# EAGLE design myRadioAddon (EAGLE 7.6.0)
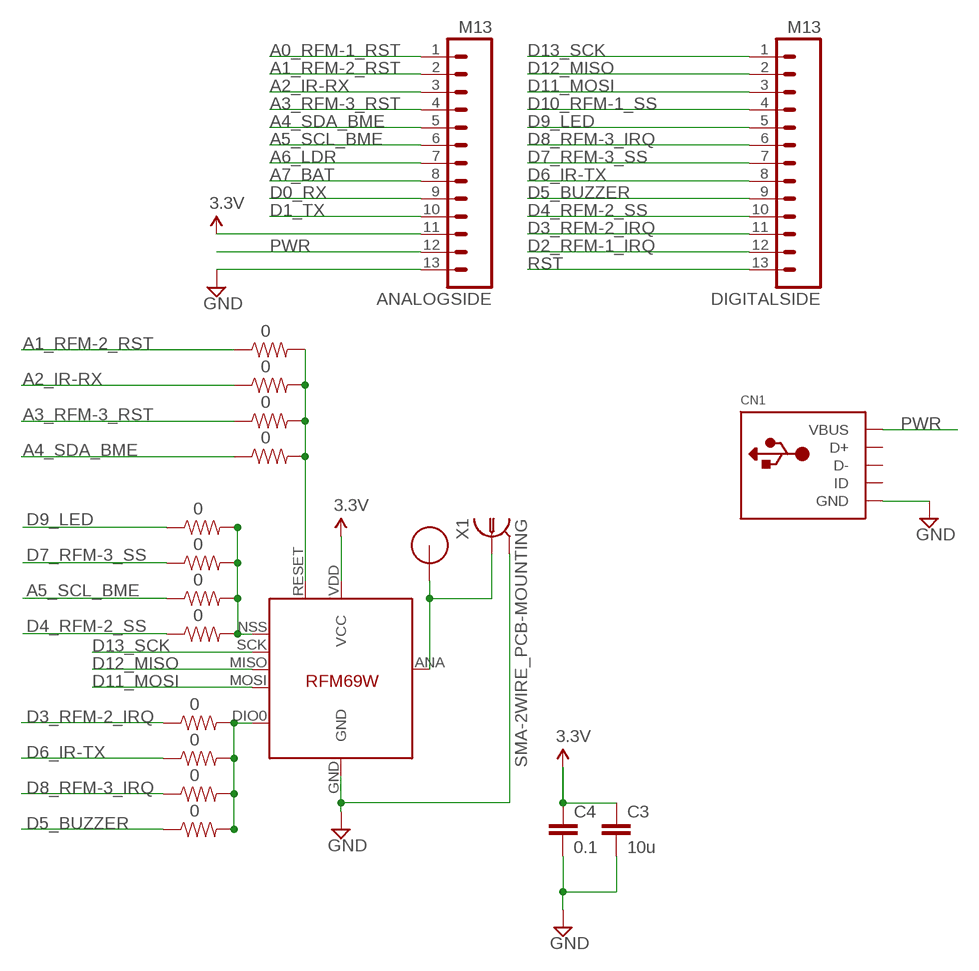
[diagram p0: schematic, sheet 1]

## Parts
ANALOGSIDE  M13  [1X13]
C3  10u  CAP0805-CAP  [0805-CAP]
C4  0.1  CAP0603-CAP  [0603-CAP]
CN1  USBMINIB  [USB-MINIB]
DIGITALSIDE  M13  [1X13]
R1  0  RESISTOR0603-RES  [0603-RES]
R2  0  RESISTOR0603-RES  [0603-RES]
R3  0  RESISTOR0603-RES  [0603-RES]
R4  0  RESISTOR0603-RES  [0603-RES]
R5  0  RESISTOR0603-RES  [0603-RES]
R6  0  RESISTOR0603-RES  [0603-RES]
R7  0  RESISTOR0603-RES  [0603-RES]
R8  0  RESISTOR0603-RES  [0603-RES]
R9  0  RESISTOR0603-RES  [0603-RES]
R10  0  RESISTOR0603-RES  [0603-RES]
R11  0  RESISTOR0603-RES  [0603-RES]
R12  0  RESISTOR0603-RES  [0603-RES]
U$1  RFM12B_ANTENNA  [RFM12B-ANTENNA]
U$5  RFM69_MINIPADS  [RFM69W-MINPADS]
X1  SMA-2WIRE_PCB-MOUNTING  [J01151A0931]

## Nets
A0_RFM-1_RST: ANALOGSIDE.1
A1_RFM-2_RST: ANALOGSIDE.2 R3.1
A2_IR-RX: ANALOGSIDE.3 R7.1
A3_RFM-3_RST: ANALOGSIDE.4 R4.1
A4_SDA_BME: ANALOGSIDE.5 R10.1
A5_SCL_BME: ANALOGSIDE.6 R11.1
A6_LDR: ANALOGSIDE.7
A7_BAT: ANALOGSIDE.8
D0_RX: ANALOGSIDE.9
D1_TX: ANALOGSIDE.10
D2_RFM-1_IRQ: DIGITALSIDE.12
D3_RFM-2_IRQ: DIGITALSIDE.11 R1.1
D4_RFM-2_SS: DIGITALSIDE.10 R2.1
D5_BUZZER: DIGITALSIDE.9 R9.1
D6_IR-TX: DIGITALSIDE.8 R12.1
D7_RFM-3_SS: DIGITALSIDE.7 R6.1
D8_RFM-3_IRQ: DIGITALSIDE.6 R5.1
D9_LED: DIGITALSIDE.5 R8.1
D10_RFM-1_SS: DIGITALSIDE.4
D11_MOSI: DIGITALSIDE.3 U$5.MOSI
D12_MISO: DIGITALSIDE.2 U$5.MISO
D13_SCK: DIGITALSIDE.1 U$5.SCK
GND [power]: ANALOGSIDE.13 C3.2 C4.2 CN1.GND U$5.GND X1.G@1 X1.G@2 X1.G@3 X1.G@4
N$1: R1.2 R5.2 R9.2 R12.2 U$5.DIO0(DIO0/IRQ)
N$2: R2.2 R6.2 R8.2 R11.2 U$5.NSS(SEL)
N$3: U$1.P$1 U$5.ANA(ANT) X1.1
N$4: R3.2 R4.2 R7.2 R10.2 U$5.RESET
PWR [power]: ANALOGSIDE.12 CN1.VBUS
RST: DIGITALSIDE.13
VCC [power]: ANALOGSIDE.11 C3.1 C4.1 U$5.VDD(VCC) ; supply symbol labelled 3.3V
Unconnected: CN1.D+ CN1.D- CN1.ID

## Library data of the parts
ANALOGSIDE DIGITALSIDE = SparkFun-Connectors:M13: 13-pin single row .1" header; BUERKLIN: 59 F 2140
C3 = LowPowerLab:CAP: Capacitor Standard 0603 ceramic capacitor, and 0.1" leaded capacitor.; BUERKLIN: 53 D 2432
C4 = LowPowerLab:CAP: Capacitor Standard 0603 ceramic capacitor, and 0.1" leaded capacitor.; BUERKLIN: 53 D 1726
CN1 = myLib:USB: USB Connectors USBMINIB - Surface Mount Female Mini-B USB Connector 4UConnector: 06564 By microbuilder.eu Thru-hole RA Female Mini-B USB Connector 4UConnector: 18732 By ladyada.net
R1-R12 = LowPowerLab:RESISTOR: Resistor Basic schematic elements and footprints for 0603, 1206, and PTH resistors.; BUERKLIN: 26 E 816
U$1 = LowPowerLab:RFM12B_ANTENNA
U$5 = myLib:RFM69_MINIPADS
X1 = myLib:SMA-2WIRE_PCB-MOUNTING: SMA 50 Ohm Straight Jack Receptacle - PCB Mountung www.telegaertner.de Source: Buerklin Artikelnummer: J01151A0931; BUERKLIN: 76F410

## Net classes
0 default: width 0.381 mm, clearance 0.254 mm
1 power: width 0.508 mm, clearance 0.254 mm

## Board
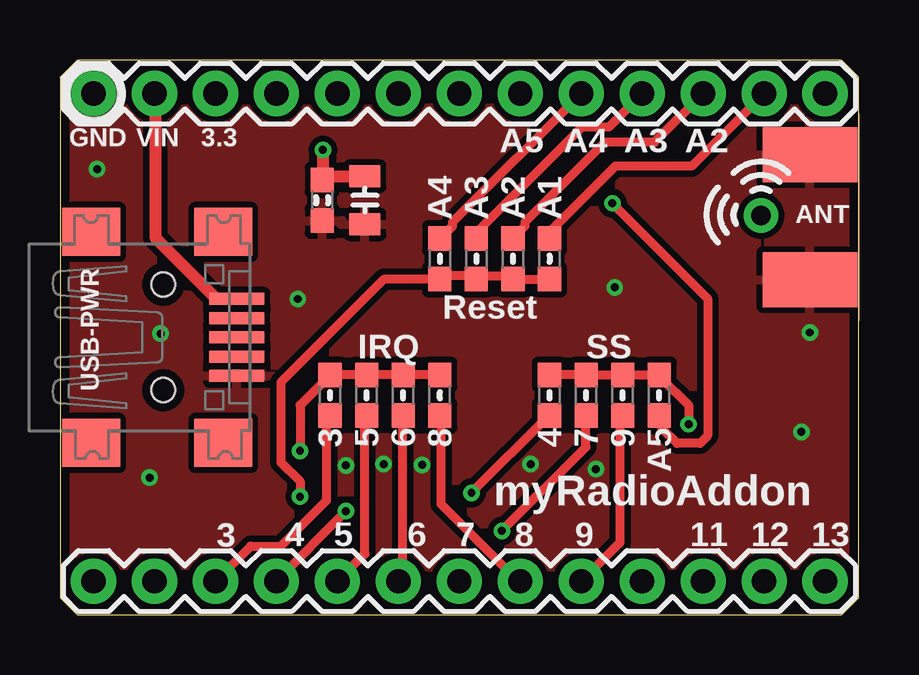
[diagram p1: board, top side]
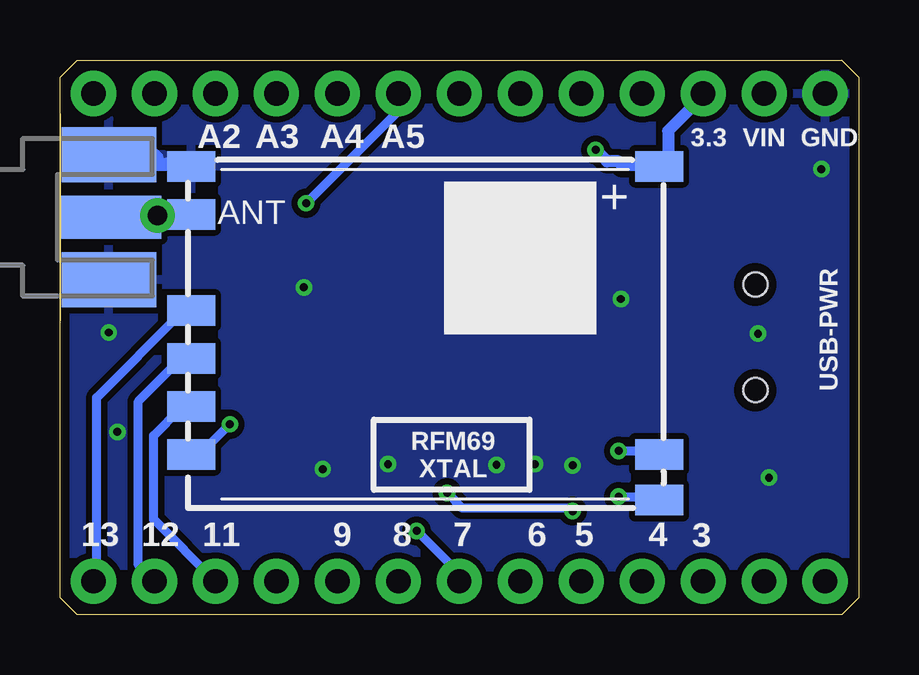
[diagram p2: board, bottom side, seen from below]

Size 33.27 x 23.11 mm. Coordinates in mm from the lower left corner, seen from the top.
Outline: 0.71,0 32.56,0 33.27,0.71 33.27,22.4 32.56,23.11 0.71,23.11 0,22.4 0,0.71 0.71,0
Copper layers (1*16): Top 0.0356mm / dielectric 1.5011mm / Bottom 0.0356mm
Design rules "oshpark-2layer *": minimum track width 6mil, minimum drill 13mil, track to track 6mil, track to pad 6mil, pad to pad 6mil, via to via 6mil, smd to smd 6mil, copper to edge 15mil, drill to drill 6mil, minimum pad ring 7mil, minimum via ring 7mil, stop-mask expansion 2.5mil, vias tented up to drill 100mil, thermal gap 10mil

### Footprints (pad centres in the part's own frame; a part is rotated, then mirrored left to right if it is on the bottom)
1X13 = drill 1.016 pad 1.88: 1 0,0; 2 2.54,0; 3 5.08,0; 4 7.62,0; 5 10.16,0; 6 12.7,0; 7 15.24,0; 8 17.78,0; 9 20.32,0; 10 22.86,0; 11 25.4,0; 12 27.94,0; 13 30.48,0
0805-CAP = smd 0.902 x 1.3: 1 -1,0; 2 1,0
0603-CAP = smd 1.016 x 0.965: 1 -0.85,0; 2 0.85,0
USB-MINIB = smd 0.5 x 2.308: D+ 0,4.064; D- -0.8,4.064; GND 1.6,4.064; ID 0.8,4.064; VBUS -1.6,4.064 | smd 2 x 2.4: GND1 -4.4,-2; GND2 -4.4,3.5; GND3 4.4,3.5; GND4 4.4,-2 | hole 1: -2.2,1; 2.2,1
0603-RES = smd 1.016 x 0.965: 1 -0.85,0; 2 0.85,0
RFM12B-ANTENNA = drill 0.8 pad 1.422: P$1 0,0
RFM69W-MINPADS = smd 2 x 1.27: ANA 8,-5; DIO0 -11.5,5; GND 8,-7; MISO 8,1; MOSI 8,3; NSS 8,5; RESET -11.5,6.909; SCK 8,-1; VDD -11.5,-7
J01151A0931 = smd 4.191 x 1.778: 1 2.134,0 | smd 3.937 x 2.286: G@1 2.032,2.6; G@2 2.032,-2.6 | smd 3.937 x 2.286 bottom: G@3 2.032,2.6; G@4 2.032,-2.6

### Placement (x,y rotation side)
ANALOGSIDE  31.88,21.72 180 top
C3  12.7,17.27 270 top
C4  10.92,17.27 270 top
CN1  3.3,11.56 270 top
DIGITALSIDE  31.88,1.4 180 top
R1  11.25,9.14 90 top
R2  20.4,9.14 90 top
R3  20.4,14.83 270 top
R4  17.35,14.83 270 top
R5  15.82,9.14 90 top
R6  21.92,9.14 90 top
R7  18.87,14.83 270 top
R8  23.44,9.14 90 top
R9  12.78,9.14 90 top
R10  15.82,14.83 270 top
R11  24.97,9.14 90 top
R12  14.3,9.14 90 top
U$1  29.21,16.64 0 top
U$5  19.81,11.68 180 bottom
X1  33.27,16.56 0 bottom

### Tracks (layer width: path | path; a pad name or v marks a point on that pad's centre or on a via)
A1_RFM-2_RST
  Top 0.381: ANALOGSIDE.2 26.31,18.69 23.14,18.69 20.32,15.88 R3.1 20.48,15.72
A2_IR-RX
  Top 0.381: ANALOGSIDE.3 24.77,19.68 22.7,19.68 19.37,16.35 19.37,16.19 18.89,15.72 R7.1
A3_RFM-3_RST
  Top 0.381: ANALOGSIDE.4 22.86,20.32 21.75,20.32 17.46,16.03 17.46,15.72 R4.1
A4_SDA_BME
  Top 0.381: ANALOGSIDE.5 16.35,16.35 16.35,16.19 15.88,15.72 R10.1
A5_SCL_BME  (via drill 0.33)
  Top 0.381: v23.02,17.14 26.99,13.18 26.99,7.46 26.67,7.14 25.72,7.14 25.08,7.78 25.08,8.26 R11.1
  Bottom 0.381: v23.02,17.14 19.21,20.95 19.21,21.59 ANALOGSIDE.6
D3_RFM-2_IRQ
  Top 0.381: DIGITALSIDE.11 7.94,2.86 9.21,2.86 11.11,4.76 11.11,8.26 R1.1
D4_RFM-2_SS  (via drill 0.33)
  Top 0.381: v17.14,5.08 20.32,8.26 R2.1 | DIGITALSIDE.10 v11.91,4.32
  Bottom 0.381: v17.14,5.08 16.51,4.45 12.06,4.45 v11.91,4.32
D5_BUZZER
  Top 0.381: DIGITALSIDE.9 12.7,2.54 12.7,8.26 R9.1
D6_IR-TX
  Top 0.381: DIGITALSIDE.8 14.29,1.59 14.29,8.26 R12.1
D7_RFM-3_SS  (via drill 0.33)
  Top 0.381: v18.41,3.49 21.91,6.99 21.91,8.26 R6.1
  Bottom 0.381: v18.41,3.49 16.67,1.75 16.67,1.43 DIGITALSIDE.7
D8_RFM-3_IRQ
  Top 0.381: R5.1 15.88,8.26 15.88,4.6 19.05,1.43 DIGITALSIDE.6
D9_LED
  Top 0.381: DIGITALSIDE.5 23.34,3.02 23.34,8.26 R8.1
D11_MOSI
  Bottom 0.381: DIGITALSIDE.3 29.37,3.97 29.37,7.46 28.26,8.57 27.94,8.57 U$5.MOSI
D12_MISO
  Bottom 0.381: DIGITALSIDE.2 30,2.06 30,8.89 28.26,10.64 27.94,10.64 U$5.MISO
D13_SCK
  Bottom 0.381: U$5.SCK 27.94,12.54 28.26,12.54 31.75,9.05 31.75,1.43 DIGITALSIDE.1
GND  (via drill 0.33)
  Bottom 0.508: X1.G@3 31.11,19.21 29.37,19.21 29.21,19.05 29.37,18.89 29.37,18.73 28.89,18.73 28.83,18.81
  other vias: 30.89,7.62 23.11,13.64 9.91,13.16 4.19,11.71 3.73,5.71 1.55,18.57 31.24,11.76 11.91,6.22 13.49,6.27 15.09,6.25 19.61,6.27 22.33,6.07
  pour Bottom: -0.64,24 -1.42,-0.48 35.74,-1.55 34.04,24
  pour Top: -0.64,24 -0.89,-1.37 34.85,-1.24 34.04,24
N$1  (via drill 0.33)
  Top 0.381: R5.2 15.72,10 14.45,10 R12.2 14.13,10 12.86,10 R9.2 12.7,10 11.27,10 R1.2 11.11,9.84 10,8.73 v10,6.83
  Bottom 0.381: v10,6.83 8.41,6.83 U$5.DIO0
N$2  (via drill 0.33)
  Top 0.381: R2.2 20.48,10 21.91,10 R6.2 22.07,10 23.34,10 R8.2 23.5,10 24.92,10 R11.2 25.08,9.84 26.19,8.73 v26.19,7.94
  Bottom 0.381: v26.19,7.94 27.3,6.83 27.78,6.83 U$5.NSS
N$3
  Bottom 1.016: U$5.ANA 29.21,16.68 U$1.P$1 31.14,16.64 X1.1
N$4  (via drill 0.33)
  Top 0.381: R3.2 20.32,13.97 19.05,13.97 R7.2 18.73,14.13 17.46,14.13 R4.2 17.3,14.13 15.88,14.13 R10.2 15.72,13.97 13.49,13.97 9.21,9.68 9.21,6.35 10,5.56 v10,4.92
  Bottom 0.381: v10,4.92 8.41,4.92 U$5.RESET
PWR
  Top 0.508: CN1.VBUS 7.3,13.18 6.51,13.18 3.97,15.72 3.97,21.59 ANALOGSIDE.12
VCC  (via drill 0.33)
  Top 0.508: C3.1 12.7,18.26 10.95,18.26 C4.1 10.95,18.41 v10.95,19.37
  Bottom 0.508: v10.95,19.37 10.48,18.89 10,18.89 9.84,18.73 8.41,18.73 U$5.VDD | 8.1,18.73 U$5.VDD | U$5.VDD 7.94,18.89 7.94,20.16 6.51,21.59 ANALOGSIDE.11

### Text on the board
tPlace: myRadioAddon
bPlace: RFM69 / XTAL
_tsilk: GND | VIN | 3.3 | A5 | A4 | A3 | A2 | A4 | A3 | A2 | A1 | ANT | Reset | IRQ | SS | USB-PWR | 3 | 5 | 6 | 8 | 4 | 7 | 9 | A5 | 3 | 4 | 5 | 6 | 7 | 8 | 9 | 11 | 12 | 13
_bsilk: GND | VIN | 3.3 | A5 | A4 | A3 | A2 | USB-PWR | 3 | 4 | 5 | 6 | 7 | 8 | 9 | 11 | 12 | 13